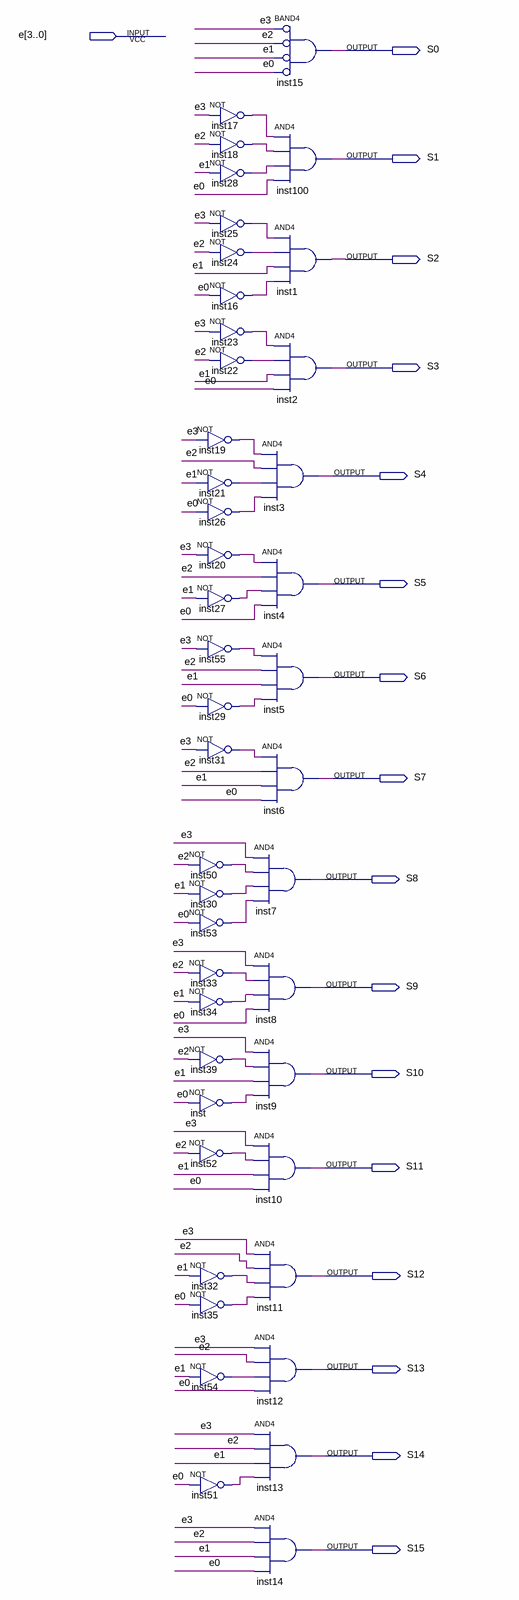
[diagram p0: schematic sheet]
// Quartus schematic mbr_decod4x16.bdf as structural Verilog: 44 symbols, 17 pins
module mbr_decod4x16 (
  input  [3:0] e,
  output S0,
  output S1,
  output S2,
  output S3,
  output S4,
  output S5,
  output S6,
  output S7,
  output S8,
  output S9,
  output S10,
  output S11,
  output S12,
  output S13,
  output S14,
  output S15
);

  wire inst16_out, inst17_out, inst18_out, inst19_out, inst20_out, inst21_out, inst22_out, inst23_out,
       inst24_out, inst25_out, inst26_out, inst27_out, inst28_out, inst29_out, inst30_out, inst31_out,
       inst32_out, inst33_out, inst34_out, inst35_out, inst39_out, inst50_out, inst51_out, inst52_out,
       inst53_out, inst54_out, inst55_out, inst_out;

  not inst17 (inst17_out, e[3]);
  not inst18 (inst18_out, e[2]);
  not inst28 (inst28_out, e[1]);
  not inst25 (inst25_out, e[3]);
  not inst24 (inst24_out, e[2]);
  not inst16 (inst16_out, e[0]);
  not inst23 (inst23_out, e[3]);
  not inst22 (inst22_out, e[2]);
  not inst19 (inst19_out, e[3]);
  not inst21 (inst21_out, e[1]);
  not inst26 (inst26_out, e[0]);
  not inst20 (inst20_out, e[3]);
  not inst27 (inst27_out, e[1]);
  not inst55 (inst55_out, e[3]);
  not inst29 (inst29_out, e[0]);
  not inst31 (inst31_out, e[3]);
  not inst50 (inst50_out, e[2]);
  not inst30 (inst30_out, e[1]);
  not inst53 (inst53_out, e[0]);
  not inst33 (inst33_out, e[2]);
  not inst34 (inst34_out, e[1]);
  not inst39 (inst39_out, e[2]);
  not inst (inst_out, e[0]);
  not inst52 (inst52_out, e[2]);
  not inst32 (inst32_out, e[1]);
  not inst35 (inst35_out, e[0]);
  not inst54 (inst54_out, e[1]);
  not inst51 (inst51_out, e[0]);
  and inst15 (S0, ~e[3], ~e[2], ~e[1], ~e[0]);  // BAND4
  and inst100 (S1, inst17_out, inst18_out, inst28_out, e[0]);
  and inst1 (S2, inst25_out, inst24_out, e[1], inst16_out);
  and inst2 (S3, inst23_out, inst22_out, e[1], e[0]);
  and inst3 (S4, inst19_out, e[2], inst21_out, inst26_out);
  and inst4 (S5, inst20_out, e[2], inst27_out, e[0]);
  and inst5 (S6, inst55_out, e[2], e[1], inst29_out);
  and inst6 (S7, inst31_out, e[2], e[1], e[0]);
  and inst7 (S8, e[3], inst50_out, inst30_out, inst53_out);
  and inst8 (S9, e[3], inst33_out, inst34_out, e[0]);
  and inst9 (S10, e[3], inst39_out, e[1], inst_out);
  and inst10 (S11, e[3], inst52_out, e[1], e[0]);
  and inst11 (S12, e[3], e[2], inst32_out, inst35_out);
  and inst12 (S13, e[3], e[2], inst54_out, e[0]);
  and inst13 (S14, e[3], e[2], e[1], inst51_out);
  and inst14 (S15, e[3], e[2], e[1], e[0]);
endmodule
